# EAGLE design NJM13700_MCP4922_DCA (EAGLE 7.2.0)
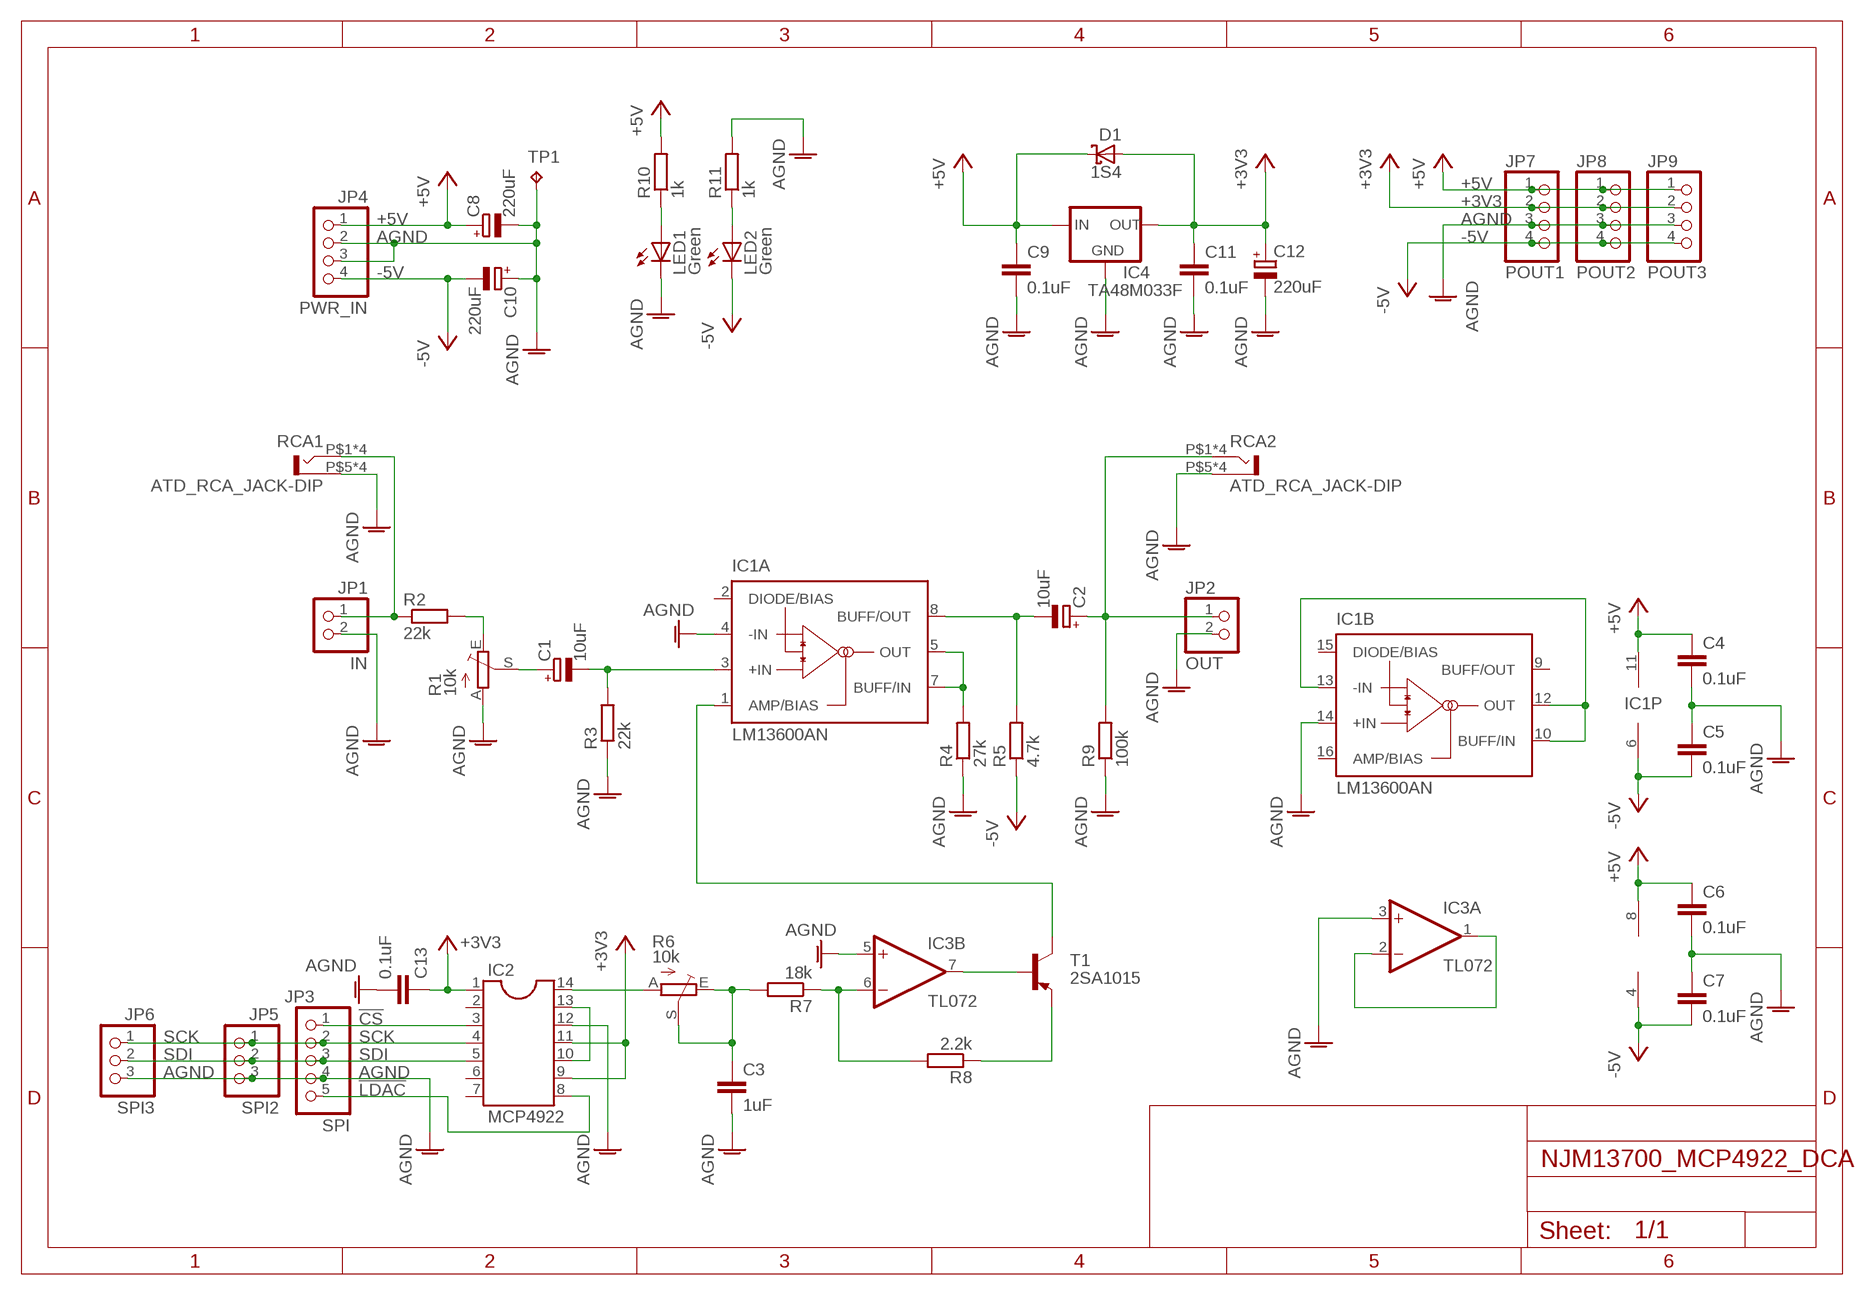
[diagram p0: schematic, sheet 1]

## Parts
C1  10uF  CPOL-EUE5-6  [E5-6]
C2  10uF  CPOL-EUE2.5-6  [E2,5-6]
C3  1uF  C-EU050-024X044  [C050-024X044]
C4  0.1uF  C-EU025-024X044  [C025-024X044]
C5  0.1uF  C-EU025-024X044  [C025-024X044]
C6  0.1uF  C-EU025-024X044  [C025-024X044]
C7  0.1uF  C-EU025-024X044  [C025-024X044]
C8  220uF  CPOL-EUE5-8.5  [E5-8,5]
C9  0.1uF  C-EU025-024X044  [C025-024X044]
C10  220uF  CPOL-EUE5-8.5  [E5-8,5]
C11  0.1uF  C-EU025-024X044  [C025-024X044]
C12  220uF  CPOL-EUE5-8.5  [E5-8,5]
C13  0.1uF  C-EU025-024X044  [C025-024X044]
D1  1S4  SCHOTTKY-DIODEDO35-7  [DO35-7]
IC1  LM13600AN  [DIL16]
IC2  MCP4922  DIL14  [DIL14]
IC3  TL072  LM4558N  [DIL08]
IC4  TA48M033F  78XXS  [78XXS]
JP1  IN  PINHD-1X2  [1X02]
JP2  OUT  PINHD-1X2  [1X02]
JP3  SPI  PINHD-1X5  [1X05]
JP4  PWR_IN  PINHD-1X4  [1X04]
JP5  SPI2  PINHD-1X3  [1X03]
JP6  SPI3  PINHD-1X3  [1X03]
JP7  POUT1  PINHD-1X4  [1X04]
JP8  POUT2  PINHD-1X4  [1X04]
JP9  POUT3  PINHD-1X4  [1X04]
LED1  Green  LED3MM  [LED3MM]
LED2  Green  LED3MM  [LED3MM]
R1  10k  TRIM_EU-B25P  [B25P]
R2  22k  R-EU_0207/7  [0207/7]
R3  22k  R-EU_0207/7  [0207/7]
R4  27k  R-EU_0207/7  [0207/7]
R5  4.7k  R-EU_0207/7  [0207/7]
R6  10k  TRIM_EU-B25P  [B25P]
R7  18k  R-EU_0207/7  [0207/7]
R8  2.2k  R-EU_0207/7  [0207/7]
R9  100k  R-EU_0207/7  [0207/7]
R10  1k  R-EU_0207/7  [0207/7]
R11  1k  R-EU_0207/7  [0207/7]
RCA1  ATD_RCA_JACK-DIP  [ATD_RCA_JACK_DIP]
RCA2  ATD_RCA_JACK-DIP  [ATD_RCA_JACK_DIP]
T1  2SA1015  -PNP-TO92-ECB  [TO92-ECB]
TP1  TPPAD1-13  [P1-13]

## Nets
!CS: IC2.3 JP3.1
!LDAC: IC2.8 JP3.5
+3V3: C11.1 C12.+ C13.2 D1.A IC2.1 IC2.9 IC2.11 IC4.OUT JP7.2 JP8.2 JP9.2
+5V: C4.1 C6.1 C8.+ C9.1 D1.C IC1.11(P:V+) IC3.8(P:V+) IC4.IN JP4.1 JP7.1 JP8.1 JP9.1 R10.2
-5V: C5.2 C7.2 C10.- IC1.6(P:V-) IC3.4(P:V-) JP4.4 JP7.4 JP8.4 JP9.4 LED2.K(C) R5.1
AGND: C3.2 C4.2 C5.1 C6.2 C7.1 C8.- C9.2 C10.+ C11.2 C12.- C13.1 IC1.4(A:-IN) IC1.14(B:+IN) IC2.12 IC3.3(A:+IN) IC3.5(B:+IN) IC4.GND JP1.2 JP2.2 JP3.4 JP4.2 JP4.3 JP5.3 JP6.3 JP7.3 JP8.3 JP9.3 LED1.K(C) R1.A R3.1 R4.1 R9.1 R11.2 RCA1.P$5(S) RCA1.P$6(S) RCA1.P$7(S) RCA1.P$8(S) RCA2.P$5(S) RCA2.P$6(S) RCA2.P$7(S) RCA2.P$8(S) TP1.TP
N$1: JP1.1 R2.1 RCA1.P$1(T) RCA1.P$2(T) RCA1.P$3(T) RCA1.P$4(T)
N$2: R1.E R2.2
N$3: C1.+ R1.S
N$4: C1.- IC1.3(A:+IN) R3.2
N$5: IC1.5(A:OUT) IC1.7(A:BUFF/IN) R4.2
N$6: C2.- IC1.8(A:BUFF/OUT) R5.2
N$7: IC2.14 R6.A
N$8: C3.1 R6.E R6.S R7.2
N$9: IC3.7(B:OUT) T1.B
N$10: IC3.6(B:-IN) R7.1 R8.2
N$11: R8.1 T1.E
N$12: IC1.1(A:AMP/BIAS) T1.C
N$13: IC2.10 IC2.13
N$14: IC1.10(B:BUFF/IN) IC1.12(B:OUT) IC1.13(B:-IN)
N$15: LED2.A R11.1
N$16: IC3.1(A:OUT) IC3.2(A:-IN)
N$17: C2.+ JP2.1 R9.2 RCA2.P$1(T) RCA2.P$2(T) RCA2.P$3(T) RCA2.P$4(T)
N$18: LED1.A R10.1
SCK: IC2.4 JP3.2 JP5.1 JP6.1
SDI: IC2.5 JP3.3 JP5.2 JP6.2
Unconnected: IC1.2(A:DIODE/BIAS) IC1.9(B:BUFF/OUT) IC1.15(B:DIODE/BIAS) IC1.16(B:AMP/BIAS) IC2.2 IC2.6 IC2.7

## Library data of the parts
C1 C2 C8 C10 C12 = rcl:CPOL-EU: POLARIZED CAPACITOR, European symbol
C3-C7 C9 C11 C13 = rcl:C-EU: CAPACITOR, European symbol
D1 = diode:SCHOTTKY-DIODE: Schottky Diode
IC1 = national-semiconductor:LM13600: Dual Operational Transconductance Amplifiers with Linearizing Diodes and Buffers Source: lm13600.PDF
IC2 = ic-package:DIL14: Dual In Line / Socket
IC3 = linear:*4558: OP AMP
IC4 = v-reg:78XXS: VOLTAGE REGULATOR
JP1 JP2 = pinhead:PINHD-1X2: PIN HEADER
JP3 = pinhead:PINHD-1X5: PIN HEADER
JP4 JP7-JP9 = pinhead:PINHD-1X4: PIN HEADER
JP5 JP6 = pinhead:PINHD-1X3: PIN HEADER
LED1 LED2 = led:LED: LED OSRAM: - CHIPLED LG R971, LG N971, LY N971, LG Q971, LY Q971, LO R971, LY R971 LH N974, LH R974 LS Q976, LO Q976, LY Q976 LO Q996 - Hyper CHIPLED LW Q18S LB Q993, LB Q99A, LB R99A - SideLED LS A670, LO A670, LY A670, LG A670, LP A670 LB A673, LV A673, LT A673, LW A673 LH A674 LY A675 LS A676, LA A676, LO A676, LY A676, LW A676 LS A679, LY A679, LG A679 - Hyper Micro SIDELED® LS Y876, LA Y876, LO Y876, LY Y876 LT Y87S - SmartLED LW L88C, LW L88S LB L89C, LB L89S, LG L890 LS L89K, LO L89K, LY L89K LS L896, LA L896, LO L896, LY L896 - TOPLED LS T670, LO T670, LY T670, LG T670, LP T670 LSG T670, LSP T670, LSY T670, LOP T670, LYG T670 LG T671, LOG T671, LSG T671 LB T673, LV T673, LT T673, LW T673 LH T674 LS T676, LA T676, LO T676, LY T676, LB T676, LH T676, LSB T676, LW T676 LB T67C, LV T67C, LT T67C, LS T67K, LO T67K, LY T67K, LW E67C LS E67B, LA E67B, LO E67B, LY E67B, LB E67C, LV E67C, LT E67C LW T67C LS T679, LY T679, LG T679 LS T770, LO T770, LY T770, LG T770, LP T770 LB T773, LV T773, LT T773, LW T773 LH T774 LS E675, LA E675, LY E675, LS T675 LS T776, LA T776, LO T776, LY T776, LB T776 LHGB T686 LT T68C, LB T68C - Hyper Mini TOPLED® LB M676 - Mini TOPLED Santana® LG M470 LS M47K, LO M47K, LY M47K Source: http://www.osram.convergy.de LUXEON: - LUMILED® LXK2-PW12-R00, LXK2-PW12-S00, LXK2-PW14-U00, LXK2-PW14-V00 LXK2-PM12-R00, LXK2-PM12-S00, LXK2-PM14-U00 LXK2-PE12-Q00, LXK2-PE12-R00, LXK2-PE12-S00, LXK2-PE14-T00, LXK2-PE14-U00 LXK2-PB12-K00, LXK2-PB12-L00, LXK2-PB12-M00, LXK2-PB14-N00, LXK2-PB14-P00, LXK2-PB14-Q00 LXK2-PR12-L00, LXK2-PR12-M00, LXK2-PR14-Q00, LXK2-PR14-R00 LXK2-PD12-Q00, LXK2-PD12-R00, LXK2-PD12-S00 LXK2-PH12-R00, LXK2-PH12-S00 LXK2-PL12-P00, LXK2-PL12-Q00, LXK2-PL12-R00 Source: www.luxeon.com KINGBRIGHT: KA-3528ASYC Source: www.kingbright.com
R1 R6 = pot:TRIM_EU-: POTENTIOMETER
R2-R5 R7-R11 = rcl:R-EU_: RESISTOR, European symbol
RCA1 RCA2 = mylib2:ATD_RCA_JACK-DIP
T1 = transistor-neu-to92:*-PNP-: PNP Transistror
TP1 = testpad:TP: Test pad

## Board
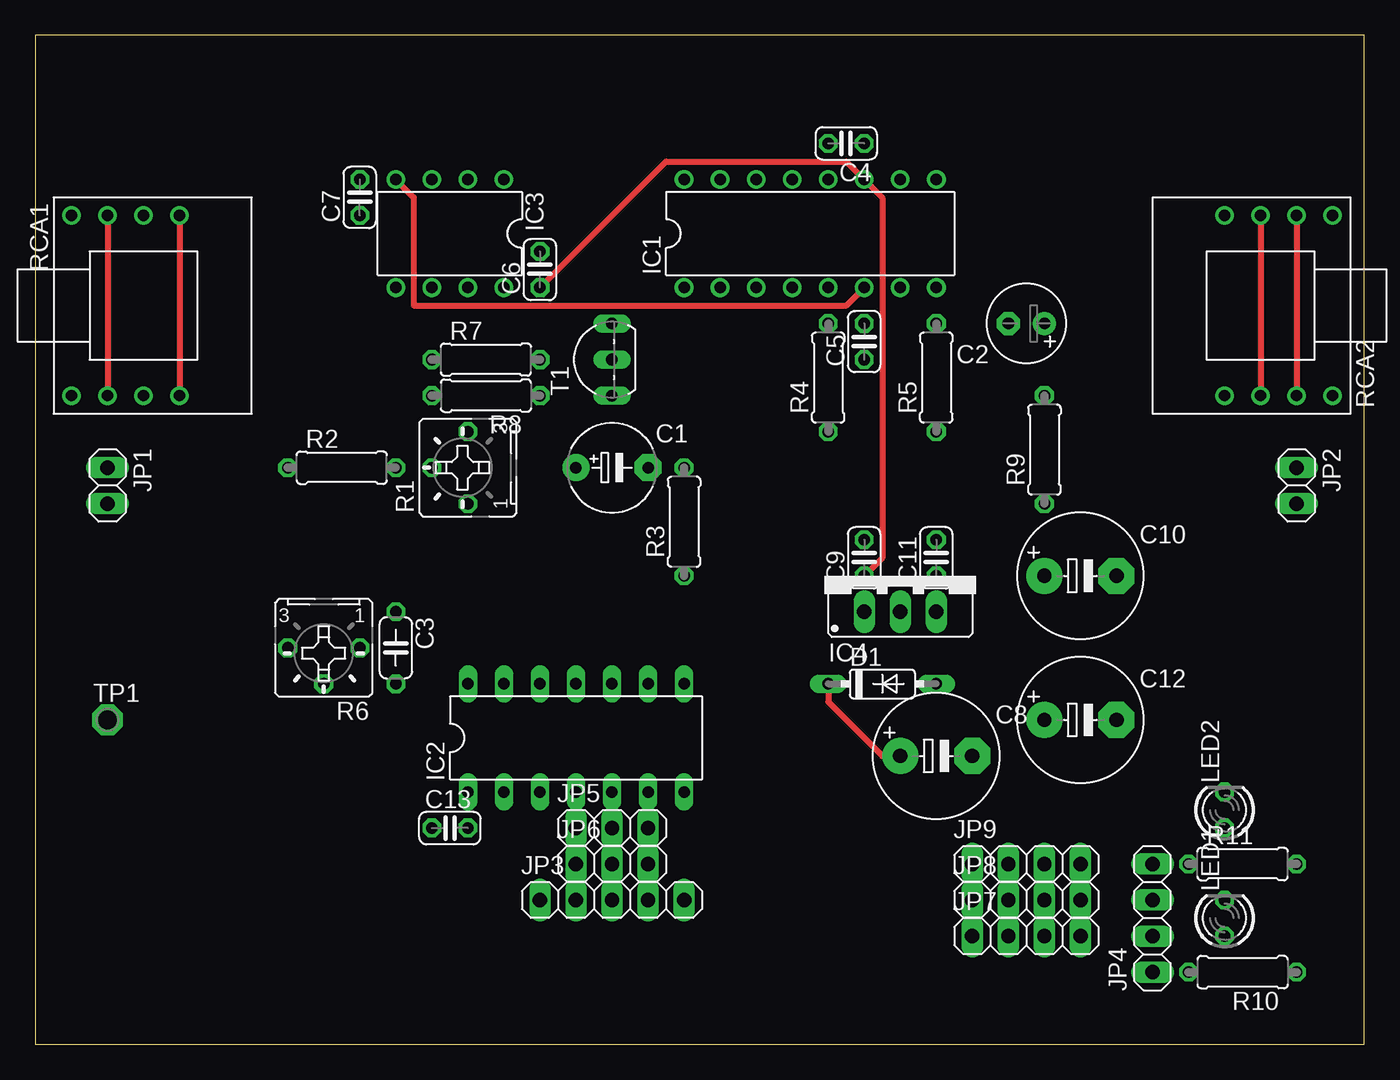
[diagram p1: board, top side]
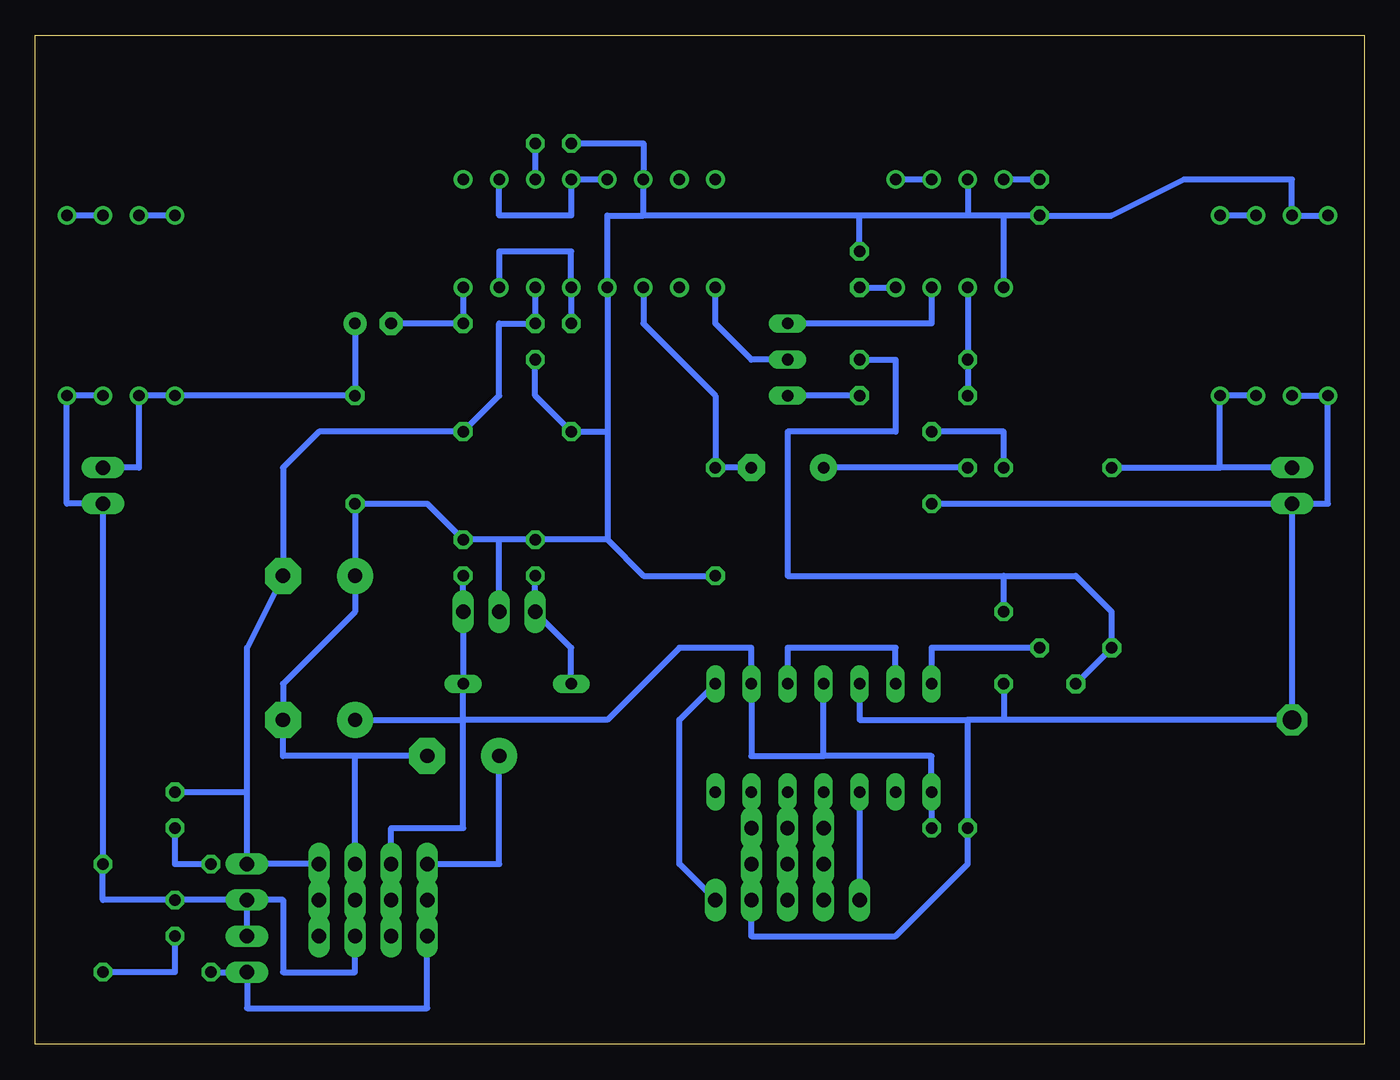
[diagram p2: board, bottom side, seen from below]

Size 93.65 x 71.11 mm. Coordinates in mm from the lower left corner, seen from the top.
Outline: 0,0 93.65,0 93.65,71.11 0,71.11 0,0
Copper layers (1*16): Top 0.035mm / dielectric 1.5mm / Bottom 0.035mm
Design rules "default": minimum track width 10mil, minimum drill 24mil, track to track 8mil, track to pad 8mil, pad to pad 8mil, via to via 8mil, smd to smd 8mil, copper to edge 40mil, drill to drill 8mil, minimum pad ring 10mil, minimum via ring 8mil, stop-mask expansion 4mil, vias tented up to drill 0mil, thermal gap 10mil

### Footprints (pad centres in the part's own frame; a part is rotated, then mirrored left to right if it is on the bottom)
E5-6 = drill 0.813 pad 1.905: + -2.54,0 | drill 0.813 pad 1.905 octagon: - 2.54,0
E2,5-6 = drill 0.813 pad 1.6: + -1.27,0 | drill 0.813 pad 1.6 octagon: - 1.27,0
C050-024X044 = drill 0.813 octagon: 1 -2.54,0; 2 2.54,0
C025-024X044 = drill 0.813 octagon: 1 -1.27,0; 2 1.27,0
E5-8,5 = drill 1.016 pad 2.54: + -2.54,0 | drill 1.016 pad 2.54 octagon: - 2.54,0
DO35-7 = drill 0.813 long: A 3.81,0; C -3.81,0
DIL16 = drill 0.813 pad 1.27: 1 -8.89,-3.81; 2 -6.35,-3.81; 3 -3.81,-3.81; 4 -1.27,-3.81; 5 1.27,-3.81; 6 3.81,-3.81; 7 6.35,-3.81; 8 8.89,-3.81; 9 8.89,3.81; 10 6.35,3.81; 11 3.81,3.81; 12 1.27,3.81; 13 -1.27,3.81; 14 -3.81,3.81; 15 -6.35,3.81; 16 -8.89,3.81
DIL14 = drill 0.813 long: 1 -7.62,-3.81; 2 -5.08,-3.81; 3 -2.54,-3.81; 4 0,-3.81; 5 2.54,-3.81; 6 5.08,-3.81; 7 7.62,-3.81; 8 7.62,3.81; 9 5.08,3.81; 10 2.54,3.81; 11 0,3.81; 12 -2.54,3.81; 13 -5.08,3.81; 14 -7.62,3.81
DIL08 = drill 0.813 pad 1.27: 1 -3.81,-3.81; 2 -1.27,-3.81; 3 1.27,-3.81; 4 3.81,-3.81; 5 3.81,3.81; 6 1.27,3.81; 7 -1.27,3.81; 8 -3.81,3.81
78XXS = drill 1.016 long: GND 0,-2.54; IN -2.54,-2.54; OUT 2.54,-2.54
1X02 = drill 1.016 long: 1 -1.27,0; 2 1.27,0
1X05 = drill 1.016 long: 1 -5.08,0; 2 -2.54,0; 3 0,0; 4 2.54,0; 5 5.08,0
1X04 = drill 1.016 long: 1 -3.81,0; 2 -1.27,0; 3 1.27,0; 4 3.81,0
1X03 = drill 1.016 long: 1 -2.54,0; 2 0,0; 3 2.54,0
LED3MM = drill 0.813 octagon: A -1.27,0; K 1.27,0
B25P = drill 0.813 octagon: A -2.54,0; E 2.54,0; S 0,2.54
0207/7 = drill 0.813 octagon: 1 -3.81,0; 2 3.81,0
ATD_RCA_JACK_DIP = drill 0.8: P$1 2.54,6.35; P$2 0,6.35; P$3 2.54,-6.35; P$4 0,-6.35; P$5 -2.54,6.35; P$6 -5.08,6.35; P$7 -2.54,-6.35; P$8 -5.08,-6.35
TO92-ECB = drill 0.813 long: B 2.54,0; C 0,0; E -2.54,0
P1-13 = drill 1.321 pad 2.159 octagon: TP 0,0

### Placement (x,y rotation side)
C1  40.64,40.64 0 top
C2  69.85,50.8 180 top
C3  25.4,27.94 270 top
C4  57.15,63.5 180 top
C5  58.42,49.53 90 top
C6  35.56,54.61 90 top
C7  22.86,59.69 90 top
C8  63.5,20.32 0 top
C9  58.42,34.29 90 top
C10  73.66,33.02 0 top
C11  63.5,34.29 90 top
C12  73.66,22.86 0 top
C13  29.21,15.24 0 top
D1  59.69,25.4 0 top
IC1  54.61,57.15 0 top
IC2  38.1,21.59 0 top
IC3  29.21,57.15 180 top
IC4  60.96,33.02 0 top
JP1  5.08,39.37 270 top
JP2  88.9,39.37 270 top
JP3  40.64,10.16 0 top
JP4  78.74,8.89 90 top
JP5  40.64,15.24 0 top
JP6  40.64,12.7 0 top
JP7  69.85,7.62 0 top
JP8  69.85,10.16 0 top
JP9  69.85,12.7 0 top
LED1  83.82,8.89 90 top
LED2  83.82,16.51 90 top
R1  30.48,40.64 90 top
R2  21.59,40.64 0 top
R3  45.72,36.83 90 top
R4  55.88,46.99 90 top
R5  63.5,46.99 90 top
R6  20.32,27.94 180 top
R7  31.75,48.26 0 top
R8  31.75,45.72 180 top
R9  71.12,41.91 90 top
R10  85.09,5.08 180 top
R11  85.09,12.7 0 top
RCA1  7.62,52.07 0 top
RCA2  86.36,52.07 180 top
T1  40.64,48.26 90 top
TP1  5.08,22.86 0 top

### Tracks (layer width: path | path; a pad name or v marks a point on that pad's centre or on a via)
!CS
  Bottom 0.406: IC2.3 JP3.1
!LDAC
  Bottom 0.406: IC2.8 48.26,22.86 48.26,12.7 JP3.5
+3V3
  Bottom 0.406: C13.2 IC2.1 30.48,20.32 38.1,20.32 | 38.1,20.32 IC2.11 | 38.1,20.32 43.18,20.32 IC2.9 43.18,27.94 48.26,27.94 53.34,22.86 63.5,22.86 | C11.1 IC4.OUT D1.A 63.5,22.86 | JP7.2 JP8.2 JP9.2 68.58,15.24 63.5,15.24 63.5,22.86 | C12.+ 63.5,22.86
+5V
  Top 0.406: D1.C 55.88,24.13 59.69,20.32 C8.+ | C9.1 59.69,34.29 59.69,59.69 IC1.11 57.15,62.23 44.45,62.23 C6.1
  Bottom 0.406: C4.1 IC1.11 | C6.1 IC3.8 | C9.1 IC4.IN 55.88,27.94 D1.C | C8.+ 60.96,12.7 JP9.1 JP8.1 JP7.1 66.04,2.54 78.74,2.54 JP4.1 R10.2
-5V
  Top 0.406: IC3.4 26.67,59.69 26.67,52.07 57.15,52.07 IC1.6
  Bottom 0.406: C7.2 IC3.4 | JP7.4 JP8.4 JP9.4 JP4.4 78.74,17.78 | IC1.6 C5.2 60.96,50.8 60.96,45.72 R5.1 73.66,43.18 76.2,40.64 C10.- 78.74,27.94 78.74,17.78 | LED2.K 78.74,17.78
AGND
  Top 0.406: RCA1.P$5 RCA1.P$7 | RCA2.P$7 RCA2.P$5
  Bottom 0.406: 25.4,58.42 C7.1 17.78,58.42 12.7,60.96 5.08,60.96 RCA1.P$5 RCA1.P$6 | 25.4,58.42 27.94,58.42 | 27.94,58.42 35.56,58.42 | 35.56,58.42 50.8,58.42 | 50.8,58.42 IC1.14 50.8,63.5 C4.2 | RCA1.P$7 RCA1.P$8 2.54,38.1 JP1.2 | IC3.3 27.94,58.42 | 27.94,22.86 C13.1 27.94,12.7 33.02,7.62 43.18,7.62 JP3.4 JP6.3 JP5.3 | IC2.12 35.56,22.86 27.94,22.86 | 53.34,43.18 IC1.4 53.34,58.42 50.8,58.42 | 53.34,43.18 53.34,35.56 | 53.34,35.56 50.8,33.02 R3.1 | 53.34,35.56 C9.2 60.96,35.56 | 53.34,43.18 R4.1 58.42,45.72 C5.1 | 60.96,35.56 C11.2 66.04,38.1 R9.1 C10.+ 71.12,30.48 76.2,25.4 C12.- 76.2,20.32 71.12,20.32 | IC4.GND 60.96,35.56 | IC3.5 25.4,58.42 | C6.2 35.56,58.42 | RCA2.P$5 RCA2.P$6 91.44,38.1 JP2.2 R11.2 88.9,10.16 LED1.K JP4.3 | RCA2.P$7 RCA2.P$8 | C8.- 71.12,20.32 | 71.12,20.32 JP9.3 JP8.3 JP7.3 71.12,5.08 76.2,5.08 76.2,10.16 JP4.3 | 25.4,22.86 TP1.TP JP1.2 | 25.4,22.86 27.94,22.86 | R1.A JP1.2 | JP4.2 JP4.3 | C3.2 25.4,22.86
N$1
  Top 0.406: RCA1.P$1 RCA1.P$3
  Bottom 0.406: RCA1.P$2 RCA1.P$1 | RCA1.P$4 RCA1.P$3 10.16,40.64 | JP1.1 10.16,40.64 | R2.1 10.16,40.64
N$2
  Bottom 0.406: R2.2 25.4,43.18 R1.E
N$3
  Bottom 0.406: R1.S C1.+
N$4
  Bottom 0.406: C1.- R3.2 45.72,45.72 50.8,50.8 IC1.3
N$5
  Bottom 0.406: R4.2 IC1.5 55.88,55.88 60.96,55.88 IC1.7
N$6
  Bottom 0.406: IC1.8 R5.2 C2.-
N$7
  Bottom 0.406: R6.A 30.48,27.94 IC2.14
N$8
  Bottom 0.406: R7.2 33.02,48.26 33.02,43.18 40.64,43.18 40.64,33.02 25.4,33.02 | R6.S R6.E 17.78,30.48 20.32,33.02 25.4,33.02 | C3.1 25.4,33.02
N$9
  Bottom 0.406: IC3.7 30.48,50.8 T1.B
N$10
  Bottom 0.406: R8.2 R7.1 IC3.6
N$11
  Bottom 0.406: R8.1 T1.E
N$12
  Bottom 0.406: T1.C 43.18,48.26 45.72,50.8 IC1.1
N$13
  Bottom 0.406: IC2.13 33.02,27.94 40.64,27.94 IC2.10
N$14
  Bottom 0.406: IC1.13 IC1.12 55.88,58.42 60.96,58.42 IC1.10
N$15
  Bottom 0.406: LED2.A 83.82,12.7 R11.1
N$16
  Bottom 0.406: IC3.2 IC3.1
N$17
  Top 0.406: RCA2.P$4 RCA2.P$2
  Bottom 0.406: RCA2.P$3 RCA2.P$4 | C2.+ R9.2 RCA2.P$1 RCA2.P$2 86.36,40.64 JP2.1
N$18
  Bottom 0.406: LED1.A 83.82,5.08 R10.1
SCK
  Bottom 0.406: IC2.4 JP5.1 JP6.1 JP3.2
SDI
  Bottom 0.406: IC2.5 JP5.2 JP6.2 JP3.3